# EAGLE schematic temp (EAGLE 6.4)
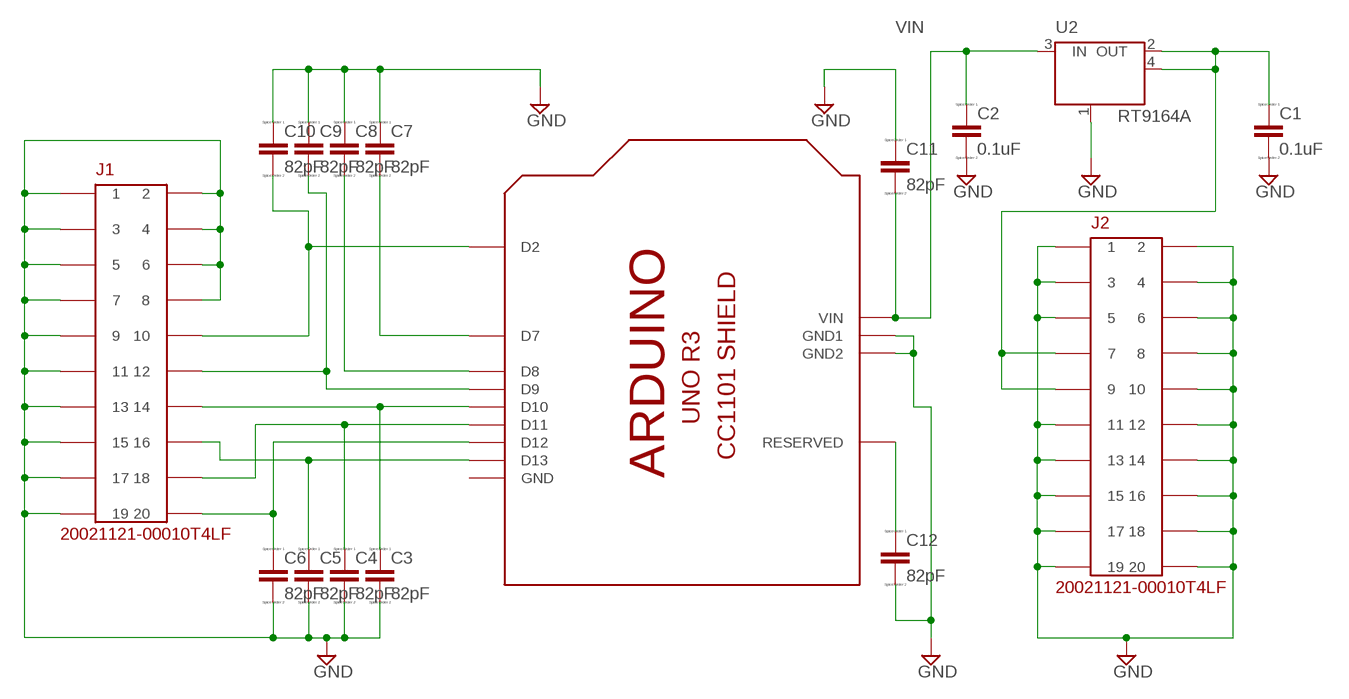
[diagram p0: schematic, sheet 1]

## Parts
C1  0.1uF  CC1206  [C1206]
C2  0.1uF  CC1206  [C1206]
C3  82pF  C  [C0805]
C4  82pF  C  [C0805]
C5  82pF  C  [C0805]
C6  82pF  C  [C0805]
C7  82pF  C  [C0805]
C8  82pF  C  [C0805]
C9  82pF  C  [C0805]
C10  82pF  C  [C0805]
C11  82pF  C  [C0805]
C12  82pF  C  [C0805]
J1  20021121-00010T4LF  [PINHDR10X2_50X50MIL_SMT]
J2  20021121-00010T4LF  [PINHDR10X2_50X50MIL_SMT]
U1  SHIELD-UNOR3-CC1101  [SHIELD-UNOR3-CC1101]
U2  RT9164A  [TO223]

## Nets
GND: C1.2 C2.2 C3.2 C4.2 C5.2 C6.2 C7.1 C8.1 C9.1 C10.1 C11.1 C12.2 J1.P$1 J1.P$2 J1.P$3 J1.P$4 J1.P$5 J1.P$6 J1.P$7 J1.P$8 J1.P$9 J1.P$11 J1.P$13 J1.P$15 J1.P$17 J1.P$19 J2.P$1 J2.P$2 J2.P$3 J2.P$4 J2.P$5 J2.P$6 J2.P$8 J2.P$10 J2.P$11 J2.P$12 J2.P$13 J2.P$14 J2.P$15 J2.P$16 J2.P$17 J2.P$18 J2.P$19 J2.P$20 U1.GND1 U1.GND2 U2.1(GND/ADJ)
N$1: C3.1 J1.P$14 U1.D10
N$2: C4.1 J1.P$18 U1.D11
N$3: C6.1 J1.P$20 U1.D12
N$4: C5.1 J1.P$16 U1.D13
N$5: C10.2 J1.P$10 U1.D2
N$6: C9.2 J1.P$12 U1.D9
N$7: C1.1 J2.P$7 J2.P$9 U2.2(OUT) U2.4(OUT)
N$8: C8.2 U1.D8
N$9: C7.2 U1.D7
N$10: C12.1 U1.RESERVED
VIN: C2.1 C11.2 U1.VIN U2.3(IN)

## Power pins joined to a net without a drawn wire
GND: U1.GND

## Library data of the parts
C1-C12 = eagle-ltspice:C: CAPACITOR, European symbol; SPICEMODEL: NONE; SPICEPREFIX: C
J1 J2 = fhpower:20021121-00010T4LF: 2x10 50mil Male Pin Header Unshrouded
U1 = adafruit-fh:SHIELD-UNOR3-CC1101
U2 = fhpower:RT9164A